# Altium project HyperDrive.PrjPcb (part 2 of 2)
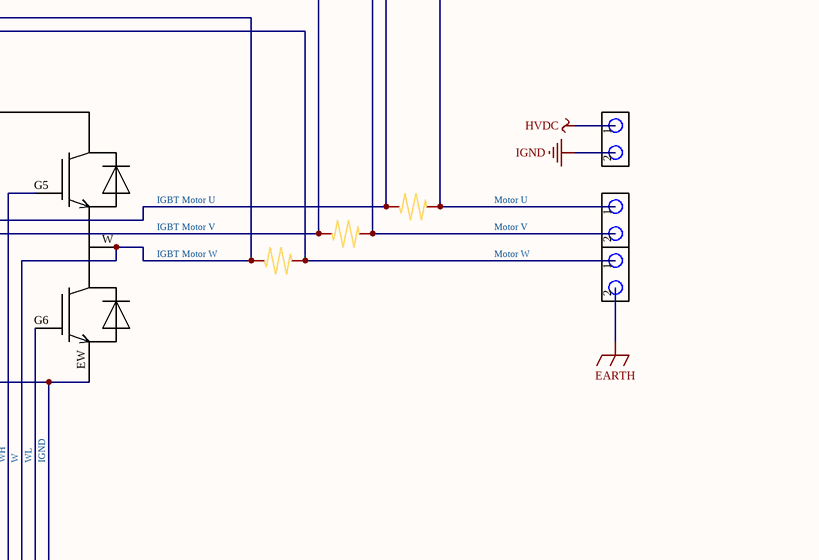
[diagram p6: HyperDrive.SchDoc, bottom right]

## Sheet HyperDrive.SchDoc (continued)

### Library data of the parts
ADC_U ADC_V ADC_W = ADC AMC1306M05: Manufacturer_Name: Texas Instruments; Manufacturer_Part_Number: AMC1306M05DWV; TYPE: TYPE; RefDes: RefDes; Copyright: Copyright (C) 2025 Ultra Librarian. All rights reserved.; Datasheet: https://www.ti.com/lit/gpn/amc1306m05
C_0.85V_1uF C_0.85V_10uF C_1.1V_1uF C_1.1V_10uF C_1.8V_1uF C_1.8V_10uF C_1.8V_Crystal-1 C_1.8V_Crystal-2 C_3.3V_1uF C_3.3V_10uF C_ADC_U-1-C_ADC_U-4 C_ADC_V-1-C_ADC_V-4 C_ADC_W-1-C_ADC_W-4 C_Backup-1-C_Backup-12 C_CAP_SOC_MCU C_CAP_SOC_VDDS0-C_CAP_SOC_VDDS6 C_CAP_SOC_VDDS_CANUART C_ClockBuffer-1 C_ClockBuffer-2 C_ClockBuffer_RMII-1 C_ClockBuffer_RMII-2 C_DCDC_I5V_IN C_DCDC_I5V_OUT C_DCDC_I9V_IN C_DCDC_I9V_OUT C_DCDC_I9V_U_IN C_DCDC_I9V_V_IN C_DCDC_I9V_V_OUT C_DCDC_I9V_W_IN C_DCDC_I9V_W_OUT C_DCDCI_9V_U_OUT C_Driver_UH C_Driver_UL C_Driver_VH C_Driver_VL C_Driver_WH C_Driver_WL C_DriverU-1 C_DriverU-2 C_DriverV-1 C_DriverV-2 C_DriverW-1 C_DriverW-2 C_ENC1_VCC1 C_ENC1_VCC2-1 C_ENC1_VCC2-2 C_ENC2_VCC1 C_ENC2_VCC2-1 C_ENC2_VCC2-2 C_EthernetPHY1-1-C_EthernetPHY1-3 C_EthernetPHY2-1-C_EthernetPHY2-3 C_LDO_3.3V-1_IN C_LDO_3.3V-1_OUT C_LDO_3.3V-2_IN C_LDO_3.3V-2_OUT C_LDO_3.3V-3_IN C_LDO_3.3V-3_OUT C_LDO_I9V_U_IN C_LDO_I9V_U_OUT C_LDO_I9V_V_IN C_LDO_I9V_V_OUT C_LDO_I9V_W_IN C_LDO_I9V_W_OUT C_LDO_PMIC_IN C_LDO_PMIC_OUT C_MMC-1-C_MMC-3 C_PMIC_0.85V-1 C_PMIC_0.85V-2 C_PMIC_0.85V_0.1uF C_PMIC_1.1V-1 C_PMIC_1.1V-2 C_PMIC_1.8V* C_PMIC_1.8V-1 C_PMIC_1.8V-2 C_PMIC_2.5V C_PMIC_InternalBypass C_PMIC_SD_VDD C_PMIC_VIN_B1_1 C_PMIC_VIN_B1_2 C_PMIC_VIN_B2 C_PMIC_VIN_B3 C_PMIC_VIN_LDO1 C_PMIC_VIN_LDO34 C_PMIC_VSYS C_RJ451_RD1 C_RJ451_RD2 C_RJ451_TD1 C_RJ451_TD2 C_RJ452_RD1 C_RJ452_RD2 C_RJ452_TD1 C_RJ452_TD2 C_SD_VDD_1uF C_SD_VDD_10uF C_VDD_CANUART C_VDD_CORE_1-C_VDD_CORE_17 C_VDDA_1P8_CSIRX0 C_VDDA_1P8_OLDI_1 C_VDDA_1P8_OLDI_2 C_VDDA_1P8_USB C_VDDA_CORE_CSIRX0 C_VDDA_CORE_USB C_VDDA_MCU C_VDDA_OSC0 C_VDDA_PLL0-C_VDDA_PLL2 C_VDDA_TEMP0 C_VDDA_TEMP1 C_VDDR_CORE_1-C_VDDR_CORE_8 C_VDDS_DDR1-C_VDDS_DDR5 C_VDDS_MEM1-C_VDDS_MEM12 C_VDDS_MEM_1P8_1 C_VDDS_MEM_1P8_2 C_VDDSHV0_1 C_VDDSHV0_2 C_VDDSHV1_1 C_VDDSHV1_2 C_VDDSHV2_1 C_VDDSHV2_2 C_VDDSHV3_1-C_VDDSHV3_4 C_VDDSHV4-C_VDDSHV6 C_VDDSHV_3P3_USB C_VDDSHV_MCU_0 C_VDDSHV_MCU_1 C_VDDSHVCANUART = Capacitor
ClockBuffer_ADC ClockBuffer_RMII = Clock Buffer LMK1C1104: Mfr_Name: Texas Instruments; TYPE: TYPE; RefDes: RefDes
Connector_5V_Main Connector_AC_UV Connector_AC_WN Connector_HVDC Connector_MOTOR_UV Connector_MOTOR_WE = Connector Terminal Screw 5.08mm: GateName_1: G$1; SymbolName_1: TERMINALBLOCK1X2; DeviceSetName: TERMINALBLOCK-1X2; LibraryName: TOTUDU; Package: SCREWTERMINAL1X2
Connector_ENC1 Connector_ENC2 = Connector RJ45: GateName_1: JP1; DeviceName: NOSHIELD; SymbolName_1: RJ45; LibraryName: TOTUDU; DeviceSetName: RJ45; Package: RJ45-NOSHIELD
CPU = CPU AM625SIP: Quad Core A53 512MB RAM
D_GateOFF_UH D_GateOFF_UL D_GateOFF_VH D_GateOFF_VL D_GateOFF_WH D_GateOFF_WL = Diode
ESD = ESD TPD6E001RSFR: Mfr_Name: Texas Instruments; RefDes: RefDes; Type: Type
EthernetPHY1_PWRDWN R_DDR0_CAL0 R_DDR_RESET R_DDRZQ R_EthernetPHY1_LED_Act R_EthernetPHY1_LED_Link R_EthernetPHY2_LED_Act R_EthernetPHY2_LED_Link R_EthernetPHY2_PWRDN R_GATE_PullDown_UH R_GATE_PullDown_UL R_GATE_PullDown_VH R_GATE_PullDown_VL R_GATE_PullDown_WH R_GATE_PullDown_WL R_GateOFF_UH R_GateOFF_UL R_GateOFF_VH R_GateOFF_VL R_GateOFF_WH R_GateOFF_WL R_GateON_UH R_GateON_UL R_GateON_VH R_GateON_VL R_GateON_WH R_GateON_WL R_I5V_Preload R_LDO3.3V-3_Pulldown_Enable R_LED_5V R_LED_I5V R_LED_I12V R_LED_I12V_U R_LED_I12V_V R_LED_I12V_W R_LoadSwitch_Pulldown_Enable R_MCU_PORZ R_MCU_RESETZ R_MMC_PULLUP_CLK R_MMC_PULLUP_CMD R_MMC_PULLUP_D0-R_MMC_PULLUP_D3 R_PMIC_Pulldown_3.3V_ENable R_PMIC_Pulldown_Enable R_PMIC_Pulldown_SD_VSEL R_PMIC_PulldownGood R_PORZ_OUT R_RBIAS_EthernetPHY1 R_RBIAS_EthernetPHY2 R_RESET_REQZ R_RESETSTATZ RMII1_Strap_Master RMII2_Strap_Address_1 RMII2_Strap_Master = Resistor
EthernetPHY2 EthernetPHY_1 = EthernetPHY DP83825IR: Manufacturer_Name: Texas Instruments; Copyright: Copyright (C) 2025 Ultra Librarian. All rights reserved.; Manufacturer_Part_Number: DP83825IRMQR; Datasheet: https://www.ti.com/lit/gpn/dp83825i; RefDes: RefDes; Type: Type
F_ADC F_ADC? F_ClockBuffer_RMII F_Driver F_ENC1_VCC1 F_ENC1_VCC2 F_ENC2_VCC1 F_ENC2_VCC2 F_EthernetPHY1 F_EthernetPHY? = Ferrite
IGBT = IGBT FP30R06W1E3
IGBTDriver_U IGBTDriver_V IGBTDriver_W = IGBTDriver UCC21550ADWR: Manufacturer_Name: Texas Instruments; Type: Power Management; Copyright: Copyright (C) 2025 Ultra Librarian. All rights reserved.; Manufacturer_Part_Number: UCC21550ADWR; Datasheet: https://www.ti.com/lit/gpn/ucc21550; RefDes: RefDes
L_PMIC_Buck1-1 L_PMIC_Buck1-2 L_PMIC_Buck2-1 L_PMIC_Buck2-2 L_PMIC_Buck3-1 L_PMIC_Buck3-2 = Inductor: SWPA6045S1R0NT
LDO_3.3V-1-LDO_3.3V-3 LDO_I5V_U LDO_I5V_V LDO_I5V_W LDO_PMIC_IN = LDO TLV767: Manufacturer_Name: Texas Instruments; Manufacturer_Part_Number: TLV76701DRVR; TYPE: TYPE; RefDes: RefDes; Copyright: Copyright (C) 2025 Ultra Librarian. All rights reserved.; Datasheet: https://www.ti.com/lit/gpn/tlv767
LED_5V LED_I5V LED_I12V LED_I12V_U LED_I12V_V LED_I12V_W = LED
LoadSwitch = LoadSwitch TPS22975DSGR: LoadSwitch 5.5V 6A; Manufacturer_Name: Texas Instruments; TYPE: TYPE; RefDes: RefDes; Copyright: Copyright (C) 2025 Ultra Librarian. All rights reserved.; Manufacturer_Part_Number: TPS22975DSGR; Datasheet: https://www.ti.com/lit/gpn/tps22975
PMIC = PMIC TPS6521901RHBR: Manufacturer_Name: Texas Instruments; Manufacturer_Part_Number: PTPS6521901RHBR; TYPE: TYPE; RefDes: RefDes; Copyright: Copyright (C) 2025 Ultra Librarian. All rights reserved.
RS485_ENC_1 RS485_ENC_2 = RS485 ISO3088: Manufacturer_Name: Texas Instruments; Manufacturer_Part_Number: ISO3088DW; Copyright: Copyright (C) 2025 Ultra Librarian. All rights reserved.; Datasheet: https://www.ti.com/lit/gpn/iso3088; RefDes: RefDes; Type: Type
X_25Mz_AM62x = Crystal CMOS: Crystal Oscilator CMOS Output; Manufacturer_Name: ECS; Manufacturer_Part_Number: ECS-2520MV-250-CN-TR; Geometry.Height: 0.9mm; Mouser Part Number: 520-2520MV-250-CN-T; Mouser Price/Stock: https://www.mouser.co.uk/ProductDetail/ECS/ECS-2520MV-250-CN-TR?qs=fAHHVMwC%252BbiTva9uv8VI%2Fw%3D%3D; Datasheet Link: https://www.arrow.com/en/products/ecs-2520mv-250-cn-tr/ecs-international